# Altium schematic sheet SCHMIDT.SchDoc
size A4
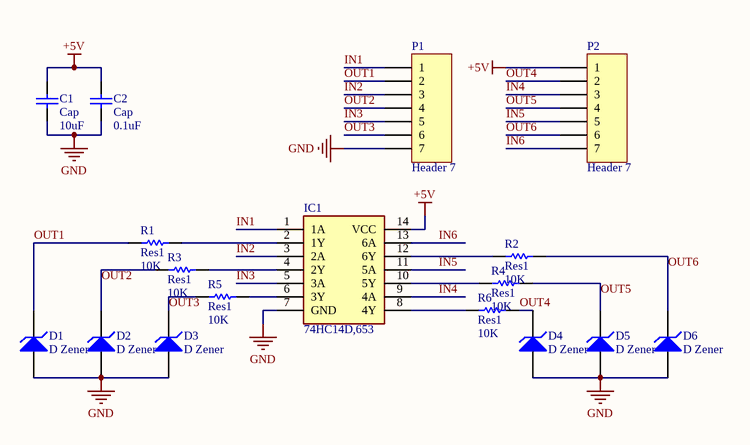
[diagram p0: SCHMIDT.SchDoc]

## Parts
C1  Cap  value 10uF  [C1206]
C2  Cap  value 0.1uF  [1608[0603]]
D1  D Zener  [C1206]
D2  D Zener  [C1206]
D3  D Zener  [C1206]
D4  D Zener  [C1206]
D5  D Zener  [C1206]
D6  D Zener  [C1206]
IC1  74HC14D,653  [SOIC127P600X175-14N]
P1  Header 7  [HDR1X7]
P2  Header 7  [HDR1X7]
R1  Res1  value 10K  [J1-0603]
R2  Res1  value 10K  [J1-0603]
R3  Res1  value 10K  [J1-0603]
R4  Res1  value 10K  [J1-0603]
R5  Res1  value 10K  [J1-0603]
R6  Res1  value 10K  [J1-0603]

## Nets
+5V: C1.2 C2.2 IC1.14(VCC) P2.1
GND: C1.1 C2.1 D1.1(A) D2.1(A) D3.1(A) D4.1(A) D5.1(A) D6.1(A) IC1.7(GND) P1.7
IN1: IC1.1(1A) P1.1
IN2: IC1.3(2A) P1.3
IN3: IC1.5(3A) P1.5
IN4: IC1.9(4A) P2.3
IN5: IC1.11(5A) P2.5
IN6: IC1.13(6A) P2.7
OUT1: D1.2(K) P1.2 R1.2
OUT2: D2.2(K) P1.4 R3.2
OUT3: D3.2(K) P1.6 R5.2
OUT4: D4.2(K) P2.2 R6.1
OUT5: D5.2(K) P2.4 R4.1
OUT6: D6.2(K) P2.6 R2.1
NetIC1_2: IC1.2(1Y) R1.1
NetIC1_4: IC1.4(2Y) R3.1
NetIC1_6: IC1.6(3Y) R5.1
NetIC1_8: IC1.8(4Y) R6.2
NetIC1_10: IC1.10(5Y) R4.2
NetIC1_12: IC1.12(6Y) R2.2

## Library data of the parts
C1 C2 = Cap: Capacitor; Published: 8-Jun-2000; LatestRevisionDate: 17-Jul-2002; LatestRevisionNote: Re-released for DXP Platform.; PackageReference: RAD-0.3; Publisher: Altium Limited; PackageDescription: Radial Cap, Thru-Hole; 2 Leads; 0.3 in Pin Spacing
D1-D6 = D Zener: Zener Diode; Published: 8-Jun-2000; LatestRevisionDate: 17-Jul-2002; LatestRevisionNote: Re-released for DXP Platform.; PackageReference: DIODE-0.7; Publisher: Altium Limited; PackageDescription: Diode, Thru-Hole; 2 Leads; 0.7 in Pin Spacing
IC1 = 74HC14D,653: Integrated Circuit; Manufacturer_Name: Nexperia; Datasheet Link: http://www.nxp.com/acrobat_download/datasheets/74HC_HCT14_3.pdf; Height: 1.75mm; Manufacturer_Part_Number: 74HC14D,653; Mouser Part Number: 771-74HC14D-T; Mouser Price/Stock: https://www.mouser.com/Search/Refine.aspx?Keyword=771-74HC14D-T; RS Part Number: 1707953; RS Price/Stock: http://uk.rs-online.com/web/p/products/1707953
P1 P2 = Header 7: Header, 7-Pin; LatestRevisionDate: 17-Jul-2002; LatestRevisionNote: Re-released for DXP Platform.; Publisher: Altium Limited
R1-R6 = Res1: Resistor; Published: 8-Jun-2000; LatestRevisionDate: 17-Jul-2002; LatestRevisionNote: Re-released for DXP Platform.; PackageReference: AXIAL-0.3; Publisher: Altium Limited; PackageDescription: Axial Device, Thru-Hole; 2 Leads; 0.3 in Pin Spacing